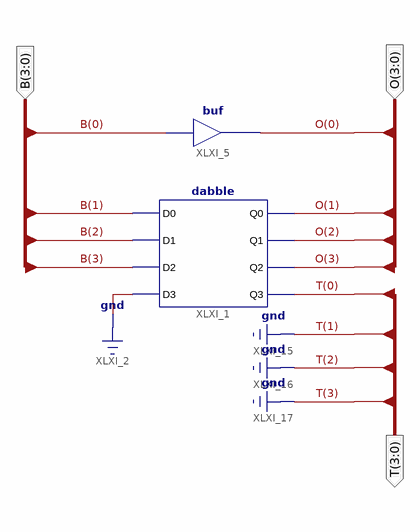
[diagram p0: schematic sheet 1]
// Xilinx ISE schematic dd4b.sch (spartan6) as structural Verilog: 2 symbols, 3 ports
module dd4b (
  input  [3:0] B,
  input  [3:0] O,
  output [3:0] T
);

  dabble XLXI_1 (.D0(B[1]), .D1(B[2]), .D2(B[3]), .D3(1'b0), .Q0(O[1]), .Q1(O[2]), .Q2(O[3]), .Q3(T[0]));
  buf XLXI_5 (O[0], B[0]);

  assign T[3:1] = 3'b000;
endmodule
